# EAGLE design lipovsky-control (EAGLE 7.7.0)
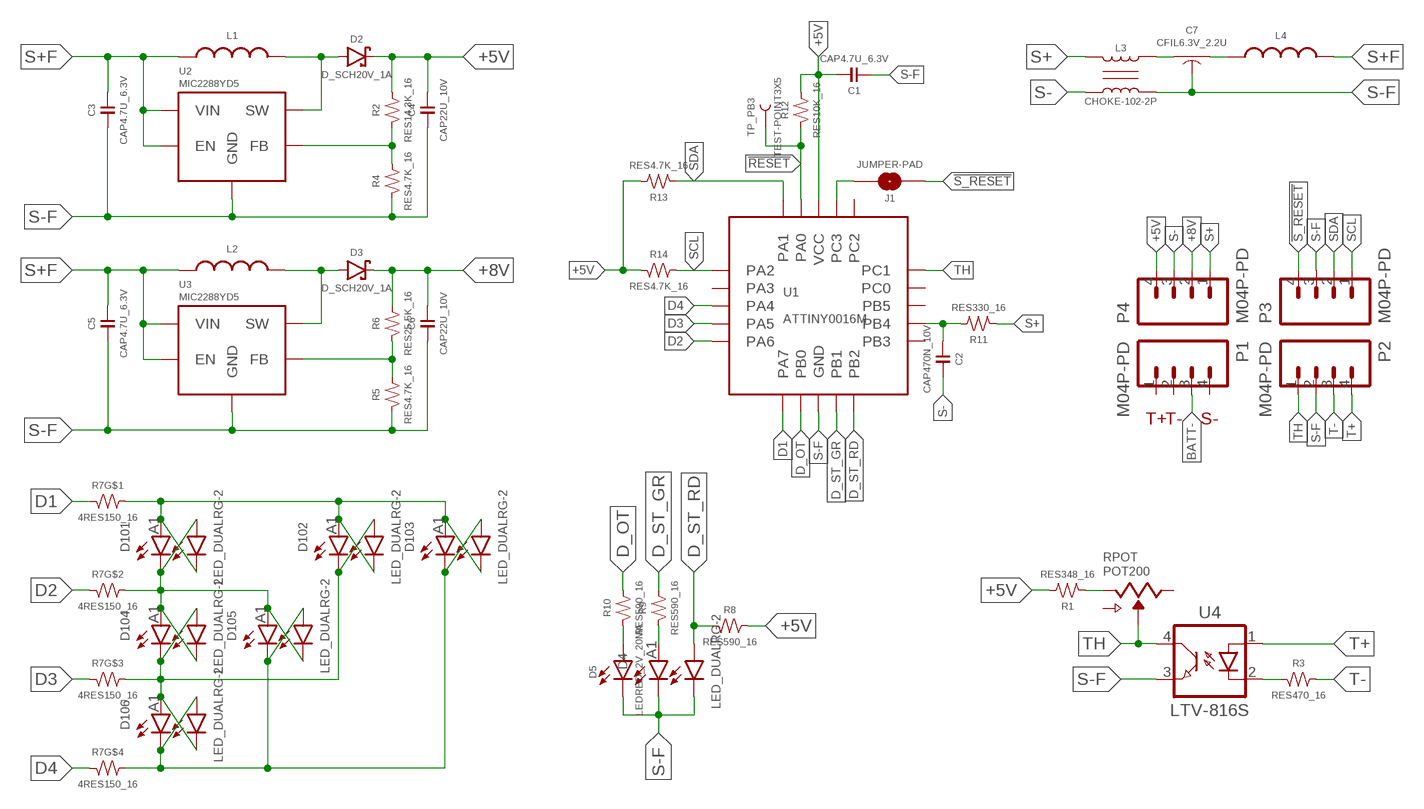
[diagram p0: schematic, sheet 1]

## Parts
C1  CAP4.7U_6.3V  [0603]
C2  CAP470N_10V  [0402]
C3  CAP4.7U_6.3V  [0603]
C4  CAP22U_10V  [0603]
C5  CAP4.7U_6.3V  [0603]
C6  CAP22U_10V  [0603]
C7  CFIL6.3V_2.2U  [CFIL-0603]
D2  D_SCH20V_1A  [SOD523+]
D3  D_SCH20V_1A  [SOD523+]
D4  LED_DUALRG-2  [1206+DUAL]
D5  LEDRED_2V_20MA  [1206+]
D101  LED_DUALRG-2  [1206+DUAL]
D102  LED_DUALRG-2  [1206+DUAL]
D103  LED_DUALRG-2  [1206+DUAL]
D104  LED_DUALRG-2  [1206+DUAL]
D105  LED_DUALRG-2  [1206+DUAL]
D106  LED_DUALRG-2  [1206+DUAL]
J1  JUMPER-PAD  [JUMPER-PAD-ROUND]
L1  I4.7U_0.12A  [0603]
L2  I10U_0.09A  [0603]
L3  CHOKE-102-2P  [APC3225]
L4  I3.3UH_1A  [0603]
P1  M04P-PD  [1X04_929P]
P2  M04P-PD  [1X04_929P]
P3  M04P-PD  [1X04_929P]
P4  M04P-PD  [1X04_929P]
R1  RES348_16  [0402]
R2  RES14.3K_16  [0402]
R3  RES470_16  [0402]
R4  RES4.7K_16  [0402]
R5  RES4.7K_16  [0402]
R6  RES25.5K_16  [0402]
R7  4RES150_16  [1206-QUAD-LS]
R8  RES590_16  [0402]
R9  RES590_16  [0402]
R10  RES590_16  [0402]
R11  RES330_16  [0402]
R12  RES10K_16  [0402]
R13  RES4.7K_16  [0402]
R14  RES4.7K_16  [0402]
RPOT  POT200  [TC33]
TP_PB3  TEST-POINT3X5  [PAD.03X.05]
U1  ATTINY0016M  [20-VQFN-2]
U2  MIC2288YD5  [SOT-23-5]
U3  MIC2288YD5  [SOT-23-5]
U4  LTV-816S  [4-OPTO-1]

## Nets
!RESET: R12.1 TP_PB3.P$1 U1.19(PA0)
!S_RESET: J1.1 P3.4
+5V: C1.2 C4.2 D2.C P4.4 R1.2 R2.2 R8.2 R12.2 R13.2 R14.1 U1.4(VCC)
+8V: C6.2 D3.C P4.2 R6.2
BATT-: P1.3
D1: R7.1 U1.8(PA7)
D1L: D101.A1 D101.C2 D102.A1 D102.C2 D103.A1 D103.C2 R7.8
D2: R7.2 U1.7(PA6)
D2L: D101.A2 D101.C1 D104.A1 D104.C2 D105.A1 D105.C2 R7.7
D3: R7.3 U1.6(PA5)
D3L: D102.A2 D102.C1 D104.A2 D104.C1 D106.A1 D106.C2 R7.6
D4: R7.4 U1.5(PA4)
D4L: D103.A2 D103.C1 D105.A2 D105.C1 D106.A2 D106.C1 R7.5
D_OT: R10.2 U1.14(PB0)
D_ST_GR: R9.2 U1.13(PB1)
D_ST_RD: D4.A2 R8.1 U1.12(PB2)
N$1: R3.1 U4.2(K)
N$2: D5.A R10.1
N$3: J1.2 U1.18(PC3)
N$4: D2.A L1.2 U2.1(SW)
N$5: D4.A1 R9.1
N$6: C7.1 L3.P$4
N$7: C7.2 L4.1
N$8: R1.1 RPOT.CCW
N$9: D3.A L2.2 U3.1(SW)
N$11: R5.2 R6.1 U3.3(FB)
N$17: R2.1 R4.2 U2.3(FB)
S+: L3.P$1 P4.1 R11.1
S+F: C3.2 C5.2 L1.1 L2.1 L4.2 U2.4(EN) U2.5(VIN) U3.4(EN) U3.5(VIN)
S-: C2.2 L3.P$2 P4.3
S-F: C1.1 C3.1 C4.1 C5.1 C6.1 C7.GND D4.C1 D4.C2 D5.C L3.P$3 P2.2 P3.3 R4.1 R5.1 U1.3(GND) U1.PAD(GND) U2.2(GND) U3.2(GND) U4.3(E)
S_ADC: C2.1 R11.2 U1.10(PB4)
SCL: P3.1 R14.2 U1.1(PA2)
SDA: P3.2 R13.1 U1.20(PA1)
T+: P2.4 U4.1(A)
T-: P2.3 R3.2
TH: P2.1 RPOT.WIPER U1.16(PC1) U4.4(C)
Unconnected: P1.1 P1.2 P1.4 RPOT.CW U1.2(PA3) U1.9(PB5) U1.11(PB3) U1.15(PC0) U1.17(PC2)

## Notes on the sheet
- T+ | T- | S-

## Library data of the parts
C1 C3 C5 = dubec:CAP: Ceramic capacitor; DIGIKEY_PART_#: 1276-2087-1-ND; EPK: 15.28; MANUFACTURER: Samsung Electro-Mechanics America, Inc.; MFG_PART_#: CL10B475KQ8NQNC; TEMP: X7R; TOLERANCE: ±10%
C2 = dubec:CAP: Ceramic capacitor; DIGIKEY_PART_#: 445-8009-1-ND; EPK: 22.25; MANUFACTURER: TDK Corporation; MFG_PART_#: C1005X7S1A474K050BC; TEMP: X7S; TOLERANCE: ±10%
C4 C6 = dubec:CAP: Ceramic capacitor; DIGIKEY_PART_#: 1276-6504-1-ND; EURO: 8.73/100; MANUFACTURER: Samsung Electro-Mechanics America, Inc.; MFG_PART_#: CL10A226MPCNUBE; TEMP: X5R; TOLERANCE: ±20%
C7 = dubec:CFIL; EURO: 13.3/100; I: 2A; MANUFACTURER: Murata Electronics; MFG_PART_#: NFM18PC225B0J3D; MOUSER_PART_#: 81-NFM18PC225B0J3D; TOLERANCE: 20 %
D2 D3 = dubec:D_SCH: Schottky diode; EURO: 13.00/100; IR: 1500 uA; MANUFACTURER: Nexperia; MFG_PART_#: PMEG2010AEB,115; MOUSER_PART_#: 771-PMEG2010AEBT/R; V_FWD: 0.29V@0.1A
D4 D101-D106 = dubec:LED_DUAL: WARNING: non-standard pin order; DIGIKEY_PART_#: 160-2026-1-ND; EPK: 93.14; I: 20mA Green, 20mA Red; LUM: 35mcd Green, 45mcd Red; MANUFACTURER: Lite-On Inc.; MFG_PART_#: LTST-C235KGKRKT; VF: 2V Green, 2V Red
D5 = dubec:LED: LED; DIGIKEY_PART_#: 160-1457-1-ND; EURO: 11.07/100; MANUFACTURER: Lite-On Inc.; MCD: 54; MFG_PART_#: LTST-C230KRKT
J1 = dubec:JUMPER-PAD
L1 = dubec:I: Inductor; DCR: 416 mOhm; DIGIKEY_PART_#: 445-6390-1-ND; EPK: 70.11; I_SAT: 120mA; MANUFACTURER: TDK Corporation; MFG_PART_#: MLZ1608M4R7WT000; NOTE: shielded; TOLERANCE: ±20%
L2 = dubec:I: Inductor; DCR: 1.365 Ohm; DIGIKEY_PART_#: 445-6389-1-ND; EPK: 70.11; MANUFACTURER: TDK Corporation; MFG_PART_#: MLZ1608M100WT000; NOTE: shielded; TOLERANCE: ±20%
L3 = dubec:CHOKE: 2 Line Common Mode Choke; DCR: 50 mOhm; DIGIKEY_PART_#: 445-174210-1-ND; EURO: 68.35/100; I: 1.5A; MANUFACTURER: TDK Corporation; MFG_PART_#: ACP3225-102-2P-TL000; VDC: 60V; Z: 1 kOhm @ 100MHz
L4 = dubec:I: Inductor; DCR: 250 mOhm; DIGIKEY_PART_#: 490-15635-1-ND; EURO: 23.67/100; ISAT: 200mA; MANUFACTURER: Murata Electronics North America; MFG_PART_#: LQM18PN3R3MGHD; TOLERANCE: ±20%
P1-P4 = dubec:M04; DIGIKEY_PART_#: 890-70-004-10-001101-ND; EURO: 12.00/100; MANUFACTURER: Preci-dip; MFG_PART_#: 890-70-004-10-001101; MOUSE_PART_#: 437-8907000410001101
R1 = dubec:RES: Resistor; DIGIKEY_PART_#: 541-348LCT-ND; EURO: 5.69/1000; MANUFACTURER: Vishay Dale; MFG_PART_#: CRCW0402348RFKED; TEMP: ±100ppm/°C; TOLERANCE: ±1%
R2 = dubec:RES: Resistor; DIGIKEY_PART_#: 541-14.3KLCT-ND; EPK: 5.24; MANUFACTURER: Vishay Dale; MFG_PART_#: CRCW040214K3FKED; TEMP: ±100ppm/°C; TOLERANCE: ±1%
R3 = dubec:RES: Resistor; DIGIKEY_PART_#: 541-470LCT-ND; EURO: 2.01/50; MANUFACTURER: Vishay Dale; MFG_PART_#: CRCW0402470RFKED; TEMP: ±100ppm/°C; TOLERANCE: ±1%
R4 R5 R13 R14 = dubec:RES: Resistor; DIGIKEY_PART_#: 541-4.70KLCT-ND; EPK: 5.24; MANUFACTURER: Vishay Dale; MFG_PART_#: CRCW04024K70FKED; TEMP: ±100ppm/°C; TOLERANCE: ±1%
R6 = dubec:RES: Resistor; DIGIKEY_PART_#: 541-25.5KLCT-ND; EPK: 5.24; MANUFACTURER: Vishay Dale; MFG_PART_#: CRCW040225K5FKED; TEMP: ±100ppm/°C; TOLERANCE: ±1%
R7 = dubec:4RES; DIGIKEY_PART_#: Y4151CT-ND; EURO: 2.37/100; MANUFACTURER: Panasonic Electronic Components; MFG_PART_#: EXB-V8V151JV; TEMP: ±200ppm/°C; TOLERANCE: ±5%
R8-R10 = dubec:RES: Resistor; DIGIKEY_PART_#: 541-590LCT-ND; EPK: 5.24; MANUFACTURER: Vishay Dale; MFG_PART_#: CRCW0402590RFKED; TEMP: ±100ppm/°C; TOLERANCE: ±1%
R11 = dubec:RES: Resistor; DIGIKEY_PART_#: 541-330LCT-ND; EPK: 5.24; MANUFACTURER: Vishay Dale; MFG_PART_#: CRCW0402330RFKED; TEMP: ±100ppm/°C; TOLERANCE: ±1%
R12 = dubec:RES: Resistor; DIGIKEY_PART_#: 541-10.0KLCT-ND; EPK: 5.24; MANUFACTURER: Vishay Dale; MFG_PART_#: CRCW040210K0FKED; TEMP: ±100ppm/°C; TOLERANCE: ±1%
RPOT = dubec:POT: Trimmer; DIGIKEY_PART_#: TC33X-2-201ECT-ND; EURO: 2.35/10; MANUFACTURER: Bourns Inc.; MFG_PART_#: TC33X-2-201E; TEMP: ±250ppm/°C; TOLERANCE: ±25%
TP_PB3 = SparkFun-Passives:TEST-POINT: Bare copper test points for troubleshooting or ICT
U1 = dubec:ATTINY0016: AVR® 8-bit CPU; DIGIKEY_PART_#: ATTINY1616-MFRCT-ND; EEPROM: 256; EURO: 15.52/25; FLASH: 16KB; MANUFACTURER: Microchip Technology; MFG_PART_#: ATTINY1616-MFR; RAM: 2K; TEMP: -40°C ~ 125°C (TA)
U2 U3 = dubec:MIC2288: MIC2288 - 1.2MHz PWM, DC/DC boost switching regulator with 34V/1A switch; DIGIKEY_PART_#: 576-1729-1-ND; EPK: 368.50; I: 1.2A; MANUFACTURER: Microchip Technology; MFG_PART_#: MIC2288YD5-TR; VIN: 2.5~10V; VOUT: 2.5~34V
U4 = dubec:LTV-8; DIGIKEY_PART_#: 160-1361-5-ND; EPK: 101.94; I_FWD: 50mA; MANUFACTURER: Lite-On Inc.; MFG_PART_#: LTV-816S; TEMP: -50°C ~ 110°C

## Board
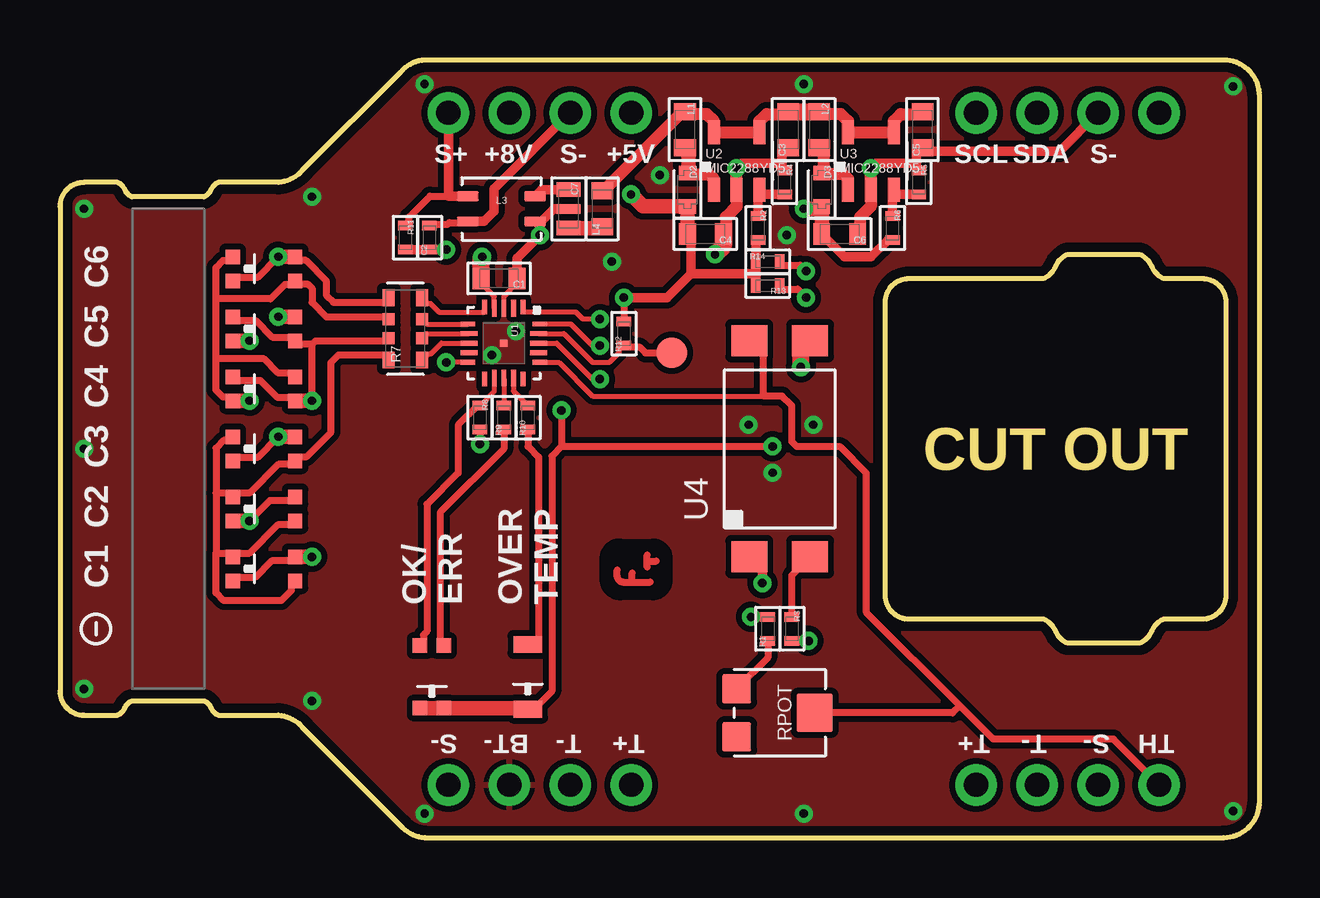
[diagram p1: board, top side]
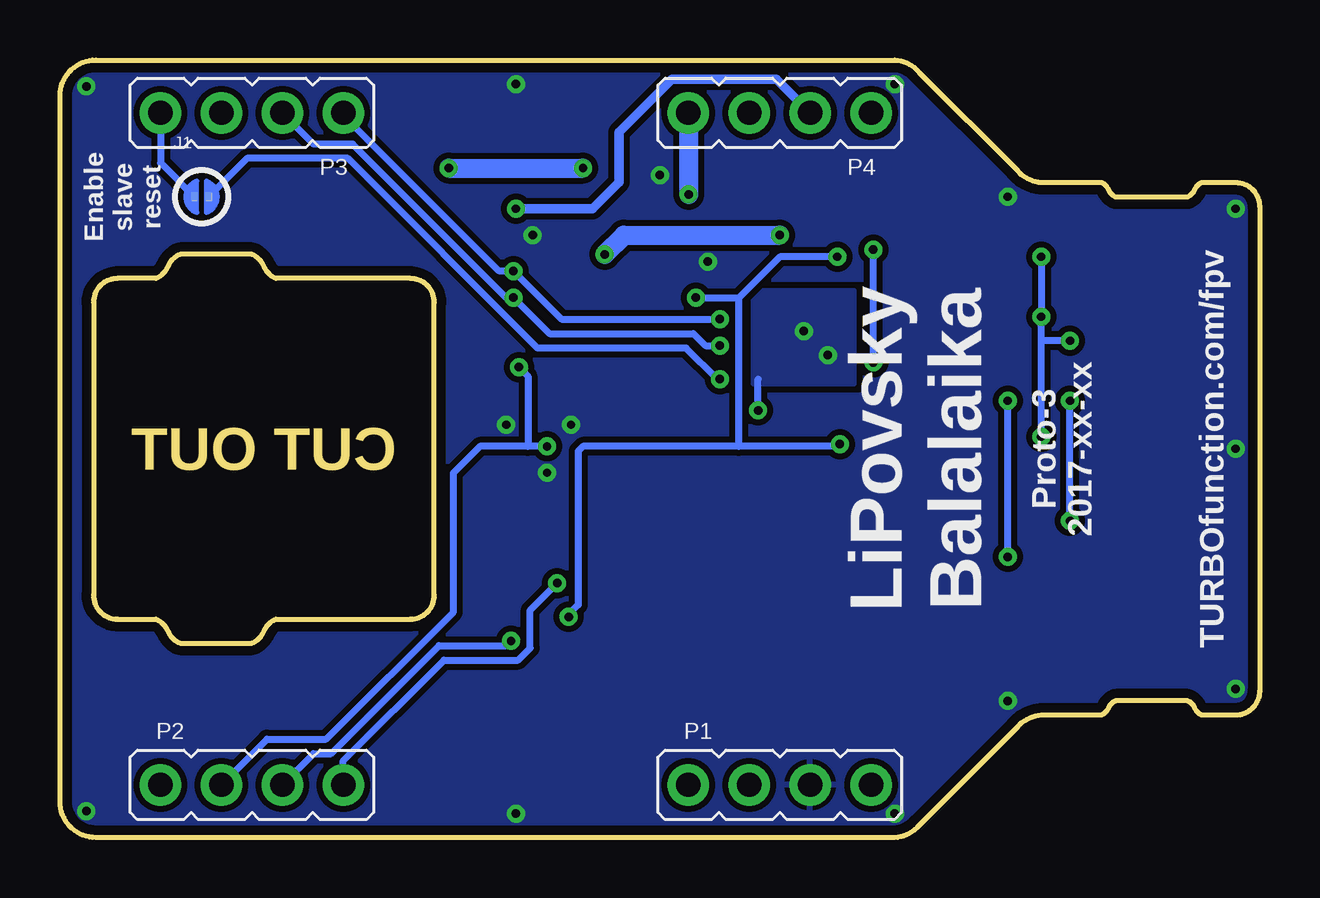
[diagram p2: board, bottom side, seen from below]

Size 50 x 32.4 mm. Coordinates in mm from the lower left corner, seen from the top.
Outline: 10.1,4.6 14.2,0.5 arc45 15.2,0 48.5,0 arc90 50,1.5 50,30.9 arc90 48.5,32.4 15.2,32.4 arc45 14.2,31.9 10.1,27.8 arc-45 9.1,27.3 6.6,27.3 arc45 6.3,27 arc-45 6,26.7 3,26.7 arc-45 2.7,27 arc45 2.4,27.3 1,27.3 arc90 0,26.3 0,6.1 arc90 1,5.1 2.4,5.1 arc45 2.7,5.4 arc-45 3,5.7 6,5.7 arc-45 6.3,5.4 arc45 6.6,5.1 9.1,5.1 arc-45 10.1,4.6
Outline: 48.6,10.1 arc-90 47.6,9.1 46,9.1 arc45 45.5,8.6 arc-45 45,8.1 42,8.1 arc-45 41.5,8.6 arc45 41,9.1 35.4,9.1 arc-90 34.4,10.1 34.4,22.3 arc-90 35.4,23.3 41,23.3 arc45 41.5,23.8 arc-45 42,24.3 45,24.3 arc-45 45.5,23.8 arc45 46,23.3 47.6,23.3 arc-90 48.6,22.3 48.6,10.1
Copper layers (1*16): Top 0.035mm / dielectric 60mil / Bottom 0.035mm
Design rules "lipovsky-control *": minimum track width 0.2mm, minimum drill 0.35mm, track to track 0.2mm, track to pad 0.2mm, pad to pad 0.2mm, via to via 0.2mm, smd to smd 0mil, copper to edge 0.4mm, drill to drill 0.4mm, minimum pad ring 0.2mm, minimum via ring 0.2mm, stop-mask expansion 0.01mm, vias tented up to drill 0.5mm, thermal gap 0.2mm

### Footprints (pad centres in the part's own frame; a part is rotated, then mirrored left to right if it is on the bottom)
0603 = smd 0.7 x 0.9: 1 -0.75,0; 2 0.75,0
0402 = smd 0.4 x 0.6: 1 -0.5,0; 2 0.5,0
CFIL-0603 = smd 0.6 x 1: 1 -0.8,0; 2 0.8,0 | smd 0.4 x 1: GND 0,0
SOD523+ = smd 0.6 x 0.7: A -0.7,0; C 0.7,0
1206+DUAL = smd 0.6 x 0.6: A1 1.3,-0.5; A2 1.3,0.5; C1 -1.3,-0.5; C2 -1.3,0.5
1206+ = smd 0.7 x 1.2: A 1.35,0; C -1.35,0
JUMPER-PAD-ROUND = smd 0.3 x 0.4: 1 -0.3,0; 2 0.3,0
APC3225 = smd 0.9 x 0.4: P$1 -1.4,0.525; P$2 -1.4,-0.525; P$3 1.4,-0.525; P$4 1.4,0.525
1X04_929P = drill 1.016: 1 -3.81,0; 2 -1.27,0; 3 1.27,0; 4 3.81,0
1206-QUAD-LS = smd 0.7 x 0.5: 1 -1.3,-0.7; 4 1.3,-0.7; 5 1.3,0.7; 8 -1.3,0.7 | smd 0.5 x 0.5: 2 -0.4,-0.7; 3 0.4,-0.7; 6 0.4,0.7; 7 -0.4,0.7
TC33 = smd 1.2 x 1.2: CCW -1,-1.8; CW 1,-1.8 | smd 1.6 x 1.5: WIPER 0,1.45
PAD.03X.05 = smd 1.27 x 1.27: P$1 0,0
20-VQFN-2 = smd 0.6 x 0.2: 1 -1.5,0.8; 5 -1.5,-0.8; 11 1.5,-0.8; 15 1.5,0.8 | smd 0.7 x 0.2: 2 -1.45,0.4; 3 -1.45,0; 4 -1.45,-0.4; 12 1.45,-0.4; 13 1.45,0; 14 1.45,0.4 | smd 0.2 x 0.6: 6 -0.8,-1.5; 10 0.8,-1.5; 16 0.8,1.5; 20 -0.8,1.5 | smd 0.2 x 0.7: 7 -0.4,-1.45; 8 0,-1.45; 9 0.4,-1.45; 17 0.4,1.45; 18 0,1.45; 19 -0.4,1.45 | smd 0.3 x 0.3: PAD 0,0
SOT-23-5 = smd 0.5 x 1: 1 -0.95,-1.2; 2 0,-1.2; 3 0.95,-1.2; 4 0.95,1.2; 5 -0.95,1.2
4-OPTO-1 = smd 1.5 x 1.3: 1 -1.27,-4.5; 2 1.27,-4.5; 3 1.27,4.5; 4 -1.27,4.5

### Placement (x,y rotation side)
C1  18.3,23.3 180 top
C2  15.4,25 90 top
C3  30.35,29.5 90 top
C4  26.9,25.15 180 top
C5  35.95,29.5 90 top
C6  32.5,25.15 180 top
C7  21.2,26.2 270 top
D2  26.15,27 270 top
D3  31.75,27 270 top
D4  15.5,6.7 90 top
D5  19.5,6.7 90 top
D101  8.5,11.2 0 top
D102  8.5,13.7 0 top
D103  8.5,16.2 0 top
D104  8.5,18.7 0 top
D105  8.5,21.2 0 top
D106  8.5,23.7 0 top
J1  44.1,26.7 0 bottom
L1  26.05,29.5 270 top
L2  31.65,29.5 270 top
L3  18.4,26.2 0 top
L4  22.6,26.2 90 top
P1  20,2.2 0 bottom
P2  42,2.2 0 bottom
P3  42,30.2 180 bottom
P4  20,30.2 180 bottom
R1  29.5,8.7 90 top
R2  29.1,25.4 270 top
R3  30.5,8.7 270 top
R4  30.2,27.3 270 top
R5  35.8,27.3 270 top
R6  34.7,25.4 270 top
R7  14.4,21.2 90 top
R8  17.5,17.5 270 top
R9  18.5,17.5 90 top
R10  19.5,17.5 90 top
R11  14.4,25 270 top
R12  23.5,21 90 top
R13  29.5,23 180 top
R14  29.5,24 0 top
RPOT  30,5.2 270 top
TP_PB3  25.5,20.2 0 top
U1  18.5,20.6 270 top
U2  28.2,28.2 0 top
U3  33.8,28.2 0 top
U4  30,16.2 0 top
U$1  [TF-EMBLEM]  24,11.2 90 top

### Tracks (layer width: path | path; a pad name or v marks a point on that pad's centre or on a via)
!RESET
  Top 0.2: U1.19 21,21 22.2,19.8 22.9,19.8 23.3,20.2 23.3,20.3 R12.1
  Top 0.3: R12.1 23.55,20.45 24.15,20.45 24.4,20.2 TP_PB3.P$1
!S_RESET
  Bottom 0.3: P3.4 45.81,28.11 J1.1
+5V  (via drill 0.35)
  Top 0.2: C1.2 17.8,23.05 17.8,22.85 18.1,22.55 U1.4
  Top 0.3: R8.2 v17.5,16.4 | v23.5,22.5 R12.2
  Top 0.4: R2.2 29,24.8 R14.1 29,23.5 | 29,23.5 R13.2 | 26.3,23.5 29,23.5 | 26.3,23.5 26.3,25 C4.2 | v23.5,22.5 25.3,22.5 26.3,23.5 | R1.2 v28.8,9.2
  Top 0.6: C4.2 D2.C 24.3,26.3 v23.8,26.8
  Top 0.7: P4.4 | C1.2 17.55,24.15 v17.6,24.2
  Bottom 0.3: 21.7,16.3 28.2,16.3 28.4,16.1 28.4,9.7 28.8,9.3 v28.8,9.2 | v17.5,16.4 17.6,16.3 21.7,16.3 | v17.6,24.2 20,24.2 21.7,22.5 | 21.7,16.3 21.7,22.5 | v23.5,22.5 21.7,22.5
  Bottom 0.8: P4.4 v23.8,26.8
+8V  (via drill 0.35)
  Top 0.4: R6.2 34.5,24.9 33.8,24.2 32.7,24.2 C6.2
  Top 0.6: C6.2 D3.C 31.65,26.2 v31,26.2
  Bottom 0.4: v31,26.2 27.8,26.2 26.7,27.3 26.7,29.4 24.5,31.6 20.13,31.6 P4.2
BATT-  (via drill 0.35)
  other vias: 1,16.2 1,26.2 1,6.2 15.2,1 15.2,31.4 48.9,1.1 48.9,31.3 10.5,26.7 10.5,5.7 31,1 31,31.4 28.7,17.2 30.3,25.1 23,24 29.7,15.2 31.4,17.2 25,27.6
  pour Top (isolate 0.25, rank 6): 0,0 50.5,0 50.5,32.9 0,32.9
  pour Bottom (isolate 0.25, rank 6): 0,0 51,0 51,33.4 0,33.4
D1
  Top 0.2: U1.8 15.9,20.6 15.45,20.15 15.35,20.15 R7.1
D1L
  Top 0.3: 6.5,11.85 6.5,10.2 6.83,9.88 9.22,9.88 9.65,10.3 9.65,10.55 D101.A1 | 6.5,11.85 7.05,11.85 D101.C2 7.35,11.85 7.9,11.85 9.1,13.05 9.65,13.05 D102.A1 | 6.5,14.35 7.05,14.35 D102.C2 7.35,14.35 7.9,14.35 9.1,15.55 9.65,15.55 D103.A1 9.95,15.85 10.25,15.85 11.3,16.9 11.3,19.8 11.6,20.1 13.5,20.1 R7.8 | 6.5,14.35 6.5,11.85 | D103.C2 7.05,16.55 6.83,16.55 6.5,16.23 6.5,14.35
D2
  Top 0.2: U1.7 15.3,21 R7.2
D2L  (via drill 0.35)
  Top 0.3: D101.C1 7.35,10.85 8.15,10.85 8.85,11.55 9.65,11.55 D101.A2 | D104.C2 7.35,19.05 8.35,19.05 9.05,18.35 9.65,18.35 D104.A1 | D105.C2 7.35,21.55 8.15,21.55 8.85,20.85 9.65,20.85 D105.A1 9.95,20.55 10.5,20.55 | v10.5,18.2 10.5,20.55 | 10.5,20.55 10.65,20.7 13.6,20.7 R7.7
  Top 0.6: D104.A1 v10.5,18.2 | D101.A2 v10.5,11.7
  Bottom 0.3: v10.5,11.7 v10.5,18.2
D3
  Top 0.2: U1.6 15.3,21.4 R7.3
D3L  (via drill 0.35)
  Top 0.3: D104.C1 7.05,18.35 6.8,18.35 6.5,18.65 6.5,19.95 | 6.5,19.95 6.5,22.45 | 6.5,22.45 6.5,23.75 6.8,24.05 7.05,24.05 D106.C2 | D104.A2 9.65,19.35 9.1,19.35 8.5,19.95 6.5,19.95 | 6.5,22.45 8.78,22.45 9.38,23.05 9.65,23.05 D106.A1 9.95,23.05 10.35,23.05 10.5,22.9 10.5,22.3 11.1,21.7 13.6,21.7 R7.6 | v7.9,13.2 8.75,14.05 9.65,14.05 D102.A2
  Top 0.6: D104.C1 v7.9,18.2 | D102.C1 v7.9,13.2
  Bottom 0.3: v7.9,13.2 v7.9,18.2
D4
  Top 0.2: U1.5 17.7,21.9 15.8,21.9 15.45,22.25 15.35,22.25 R7.4
D4L  (via drill 0.35)
  Top 0.3: D103.C1 7.35,15.85 8.25,15.85 v9.1,16.7 | D106.C1 7.35,23.35 8.25,23.35 v9.1,24.2 | D106.A2 9.95,24.05 10.25,24.05 11.1,23.2 11.1,22.6 11.4,22.3 13.5,22.3 R7.5
  Top 0.6: v9.1,16.7 D103.A2 | D106.A2 v9.1,24.2 | v9.1,21.7 D105.A2 | D105.C1 v7.9,20.7
  Bottom 0.3: v9.1,24.2 v9.1,21.7 9.1,20.7 | v9.1,16.7 9.1,20.7 | v7.9,20.7 9.1,20.7
D_OT
  Top 0.2: U1.14 18.9,18.6 R10.2
D_ST_GR
  Top 0.2: U1.13 R9.2
D_ST_RD
  Top 0.2: U1.12 18.1,18.6 R8.1
  Top 0.3: R8.1 17.4,18 16.6,17.2 16.6,15.2 15.3,13.9 15.3,8.6 15.15,8.45 15.15,8.15 D4.A2
N$1
  Top 0.3: R3.1 30.5,10.93 U4.2
N$2
  Top 0.3: R10.1 19.5,16.3 19.95,15.85 19.95,8.3 19.7,8.05 D5.A
N$3  (via drill 0.35)
  Top 0.2: U1.18 20.7,20.6 22.2,19.1 v22.5,19.1
  Bottom 0.3: J1.2 42.2,28.3 38,28.3 30.1,20.4 23.9,20.4 22.6,19.1 v22.5,19.1
N$4
  Top 0.5: D2.A 26.2,27.65 27.05,27.65 27.25,27.45 U2.1
  Top 0.6: D2.A 26.2,27.75 26.2,28.6 L1.2
N$5
  Top 0.3: R9.1 18.5,16.2 15.85,13.55 15.85,8.15 D4.A1
N$6
  Top 0.4: L3.P$4 20.07,27 C7.1
N$7
  Top 0.6: C7.2 22.55,25.4 L4.1
N$8
  Top 0.3: R1.1 29.5,7.5 RPOT.CCW
N$9
  Top 0.5: L2.2 31.85,28.55 31.85,27.8 D3.A 31.8,27.65 32.65,27.65 32.85,27.45 U3.1
N$11
  Top 0.4: R5.2 34.95,26.8 U3.3 34.7,26.95 R6.1
N$17
  Top 0.4: R4.2 29.35,26.8 U2.3 | 29.1,27 29.15,27.05 U2.3 | R2.1 29.1,26.95 U2.3
S+
  Top 0.3: R11.1 14.55,25.65 14.55,25.85 15.43,26.73 16.19,26.73
  Top 0.4: P4.1 16.19,26.73 L3.P$1
S+F
  Top 0.5: C3.2 30.25,30.15 29.45,30.15 29.15,29.85 U2.4 U2.5 27.25,29.85 26.95,30.15 26.15,30.15 L1.1 25.95,30.25 22.65,26.95 L4.2 | L2.1 31.75,30.15 32.55,30.15 32.85,29.85 U3.5 U3.4 34.75,29.85 35.05,30.15 35.85,30.15 C5.2
  Top 0.7: C3.2 L2.1
S-
  Top 0.3: C2.2 15.45,25.55 16.15,25.55 16.23,25.62 16.95,25.62 L3.P$2
  Top 0.4: P4.3 18.1,27.03 18.1,26.1 17.68,25.68 L3.P$2
S-F  (via drill 0.35)
  Top 0.2: C1.1 18.8,23.05 18.8,22.85 18.5,22.55 U1.3
  Top 0.3: v20.9,17.8 20.9,16.3 | 20.9,16.3 v29.7,16.3 | 20.9,16.3 20.5,15.9 20.5,6.1 19.75,5.35 D5.C
  Top 0.4: 30.1,28.1 30.1,27.9 R4.1 | 30.1,28.1 28.4,28.1 v28.2,27.9 | 30.1,28.1 30.1,28.5 C3.1 | 35.7,28.1 35.7,27.9 R5.1 | 35.7,28.1 35.7,28.5 C5.1 36.1,28.6 41.67,28.6 P3.3 | v33.8,27.9 34,28.1 35.7,28.1 | C7.GND 20.6,26.2 20.07,25.68 L3.P$3 20,25.48 v20,25.1 19.05,24.15 C1.1
  Top 0.5: C4.1 27.75,25.25 27.75,25.85 28.2,26.3 U2.2 v28.2,27.9 | C6.1 33.35,25.25 33.35,25.85 33.8,26.3 U3.2 v33.8,27.9
  Top 0.6: D4.C2 D4.C1 19.45,5.4 D5.C
  Top 0.7: C4.1 27.65,24.65 v27.3,24.3 | v30.88,19.6 30.88,20.3 U4.3
  Bottom 0.3: P2.2 41.37,4.1 38.9,4.1 33.6,9.4 33.6,15.2 32.5,16.3 30.5,16.3 | v20.9,17.8 20.9,19.1 | v29.7,16.3 30.5,16.3 | v30.88,19.6 30.5,19.23 30.5,16.3
  Bottom 0.8: v33.8,27.9 v28.2,27.9 | v27.3,24.3 26.5,25.1 v20,25.1
  other vias: 19,21.1 18,20.1
  pour Top (no thermals): 17.4,19.5 19.6,19.5 19.6,21.7 17.4,21.7
  pour Bottom (isolate 0.25, no thermals): 16.9,18.9 21.1,18.9 21.1,22.8 16.9,22.8
S_ADC  (via drill 0.35)
  Top 0.2: U1.10 v16.1,19.8
  Top 0.4: R11.2 C2.1 v16.1,24.5
  Bottom 0.3: v16.1,19.8 v16.1,24.5
SCL  (via drill 0.35)
  Top 0.2: v22.5,21.6 21.8,21.6 21.5,21.9 19.3,21.9 U1.1
  Top 0.3: R14.2 30.15,23.85 30.85,23.85 v31.1,23.6
  Bottom 0.3: P3.1 38.19,30.1 31.69,23.6 v31.1,23.6 29.1,21.6 v22.5,21.6
SDA  (via drill 0.35)
  Top 0.2: v22.5,20.5 22.2,20.5 21.3,21.4 U1.20
  Top 0.3: R13.1 30.15,22.85 30.75,22.85 v31.1,22.5
  Bottom 0.3: P3.2 39.43,28.9 37.8,28.9 31.4,22.5 v31.1,22.5 29.6,21 23.6,21 23.1,20.5 v22.5,20.5
T+  (via drill 0.35)
  Top 0.4: v29.27,10.6 29.27,11.15 U4.1
  Bottom 0.3: P2.4 38.19,3.21 34,7.4 30.9,7.4 30.4,7.9 30.4,9.47 v29.27,10.6
T-  (via drill 0.35)
  Top 0.4: R3.2 v31.2,8.2
  Bottom 0.3: P2.3 39.43,3.5 38.7,3.5 34.2,8 31.4,8 v31.2,8.2
TH
  Top 0.2: U1.16 20.8,19.8 22.2,18.4 29.32,18.4
  Top 0.3: P2.1 43.91,4.1 38.9,4.1 37.5,5.5 | 37.5,5.5 37.2,5.2 RPOT.WIPER | 37.5,5.5 33.6,9.4 33.6,15.2 32.5,16.3 30.7,16.3 30.5,16.5 30.5,18 30.1,18.4 29.32,18.4 29.32,20.11 U4.4

### Text on the board
Dimension: CUT OUT
tPlace: S+ | +8V | S- | +5V | SCL | SDA | S- | C6 | C5 | C4 | C3 | C2 | C1 | OK/ / ERR | OVER / TEMP | S- | BT- | T- | T+ | T+ | T- | S- | TH
bPlace: Enable / slave / reset | TURBOfunction.com/fpv | Proto-3 / 2017-xx-xx | LiPovsky / Balalaika